# Altium schematic sheet HD3SS215_PINOUT.SchDoc
size C; SheetNumber: 11; SheetTotal: 14
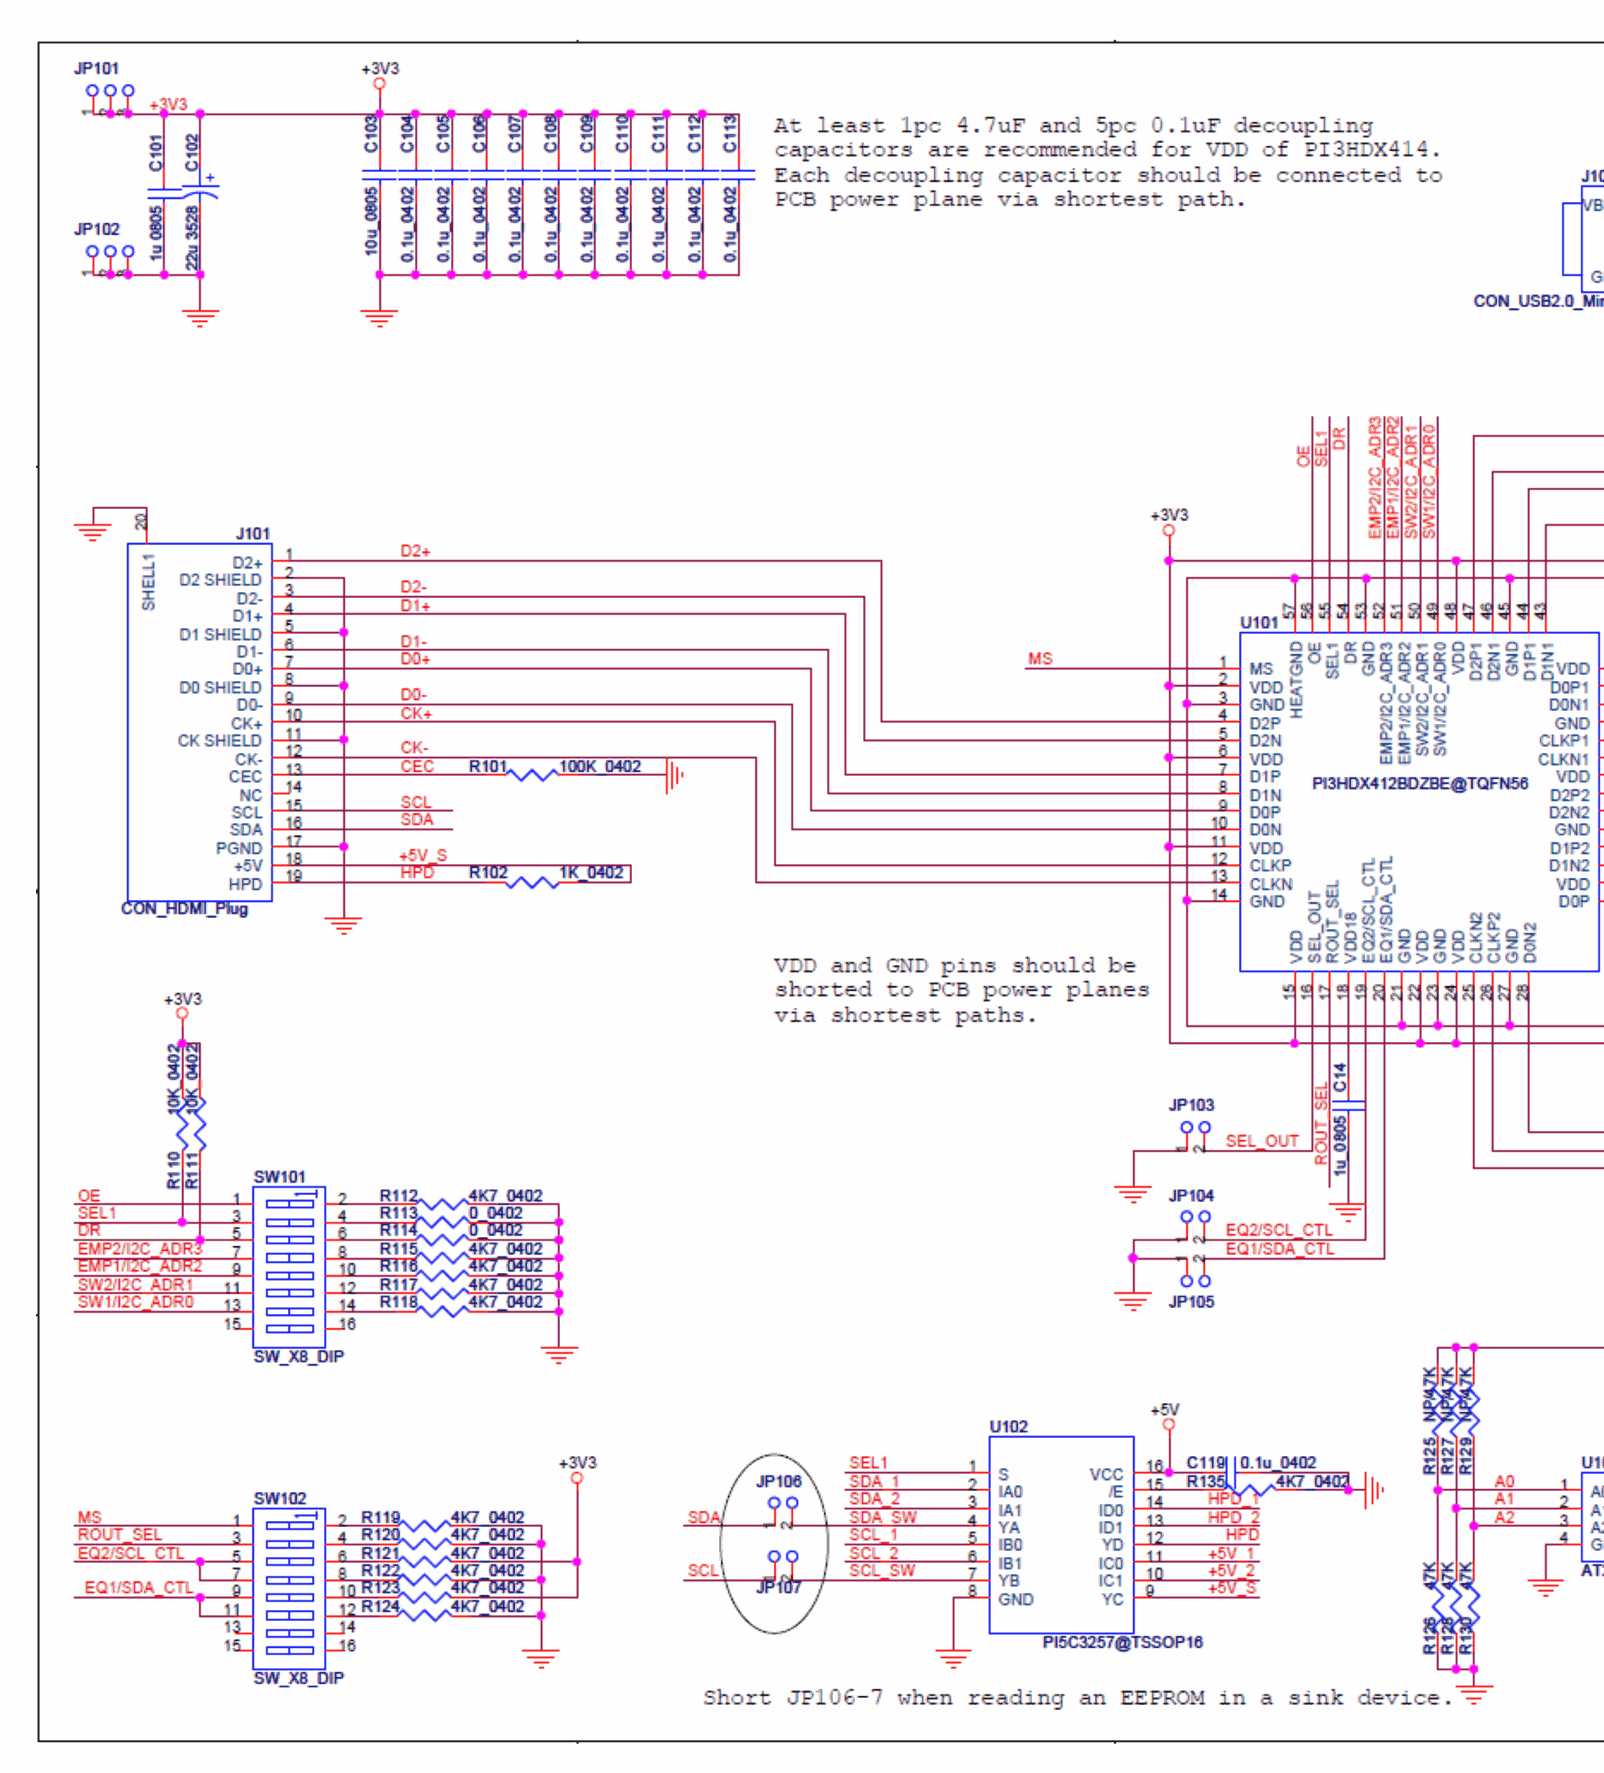
[diagram p0: HD3SS215_PINOUT.SchDoc, top left]
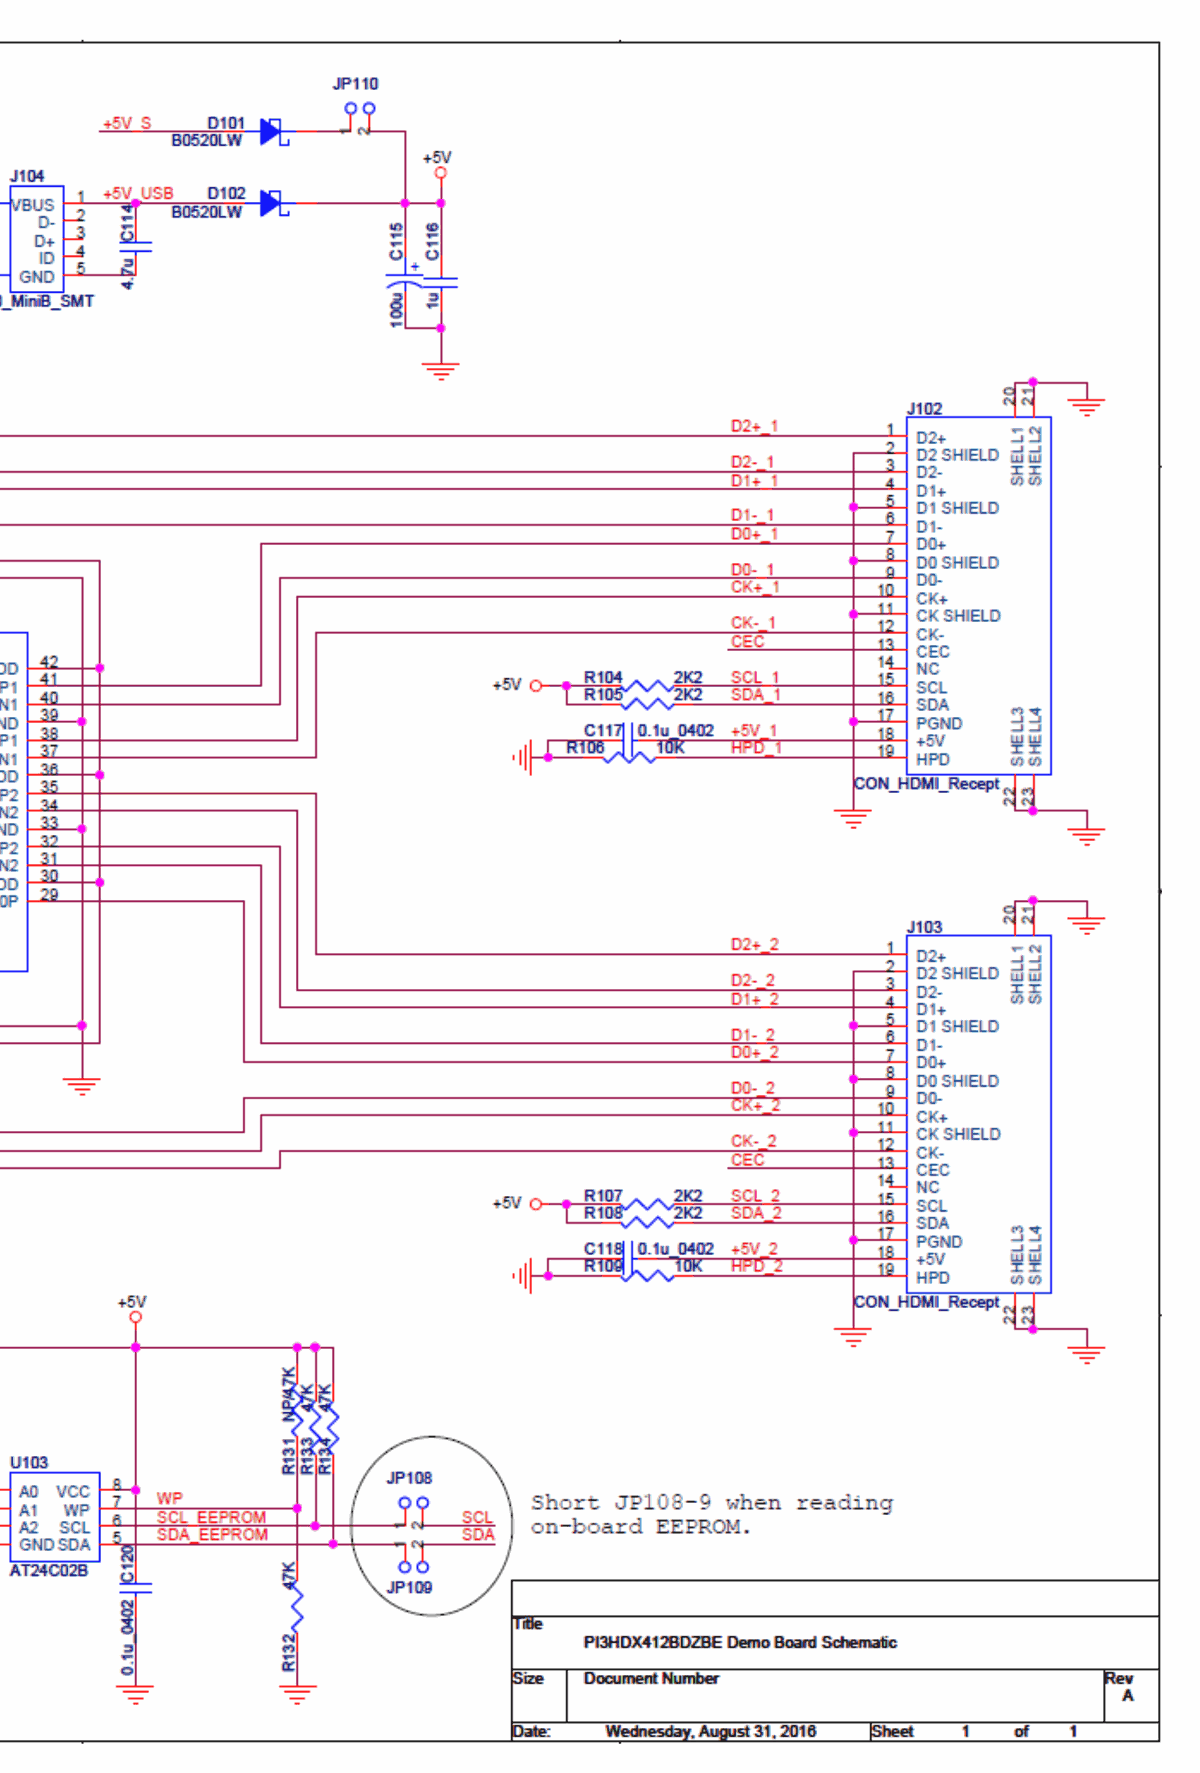
[diagram p1: HD3SS215_PINOUT.SchDoc, top right]
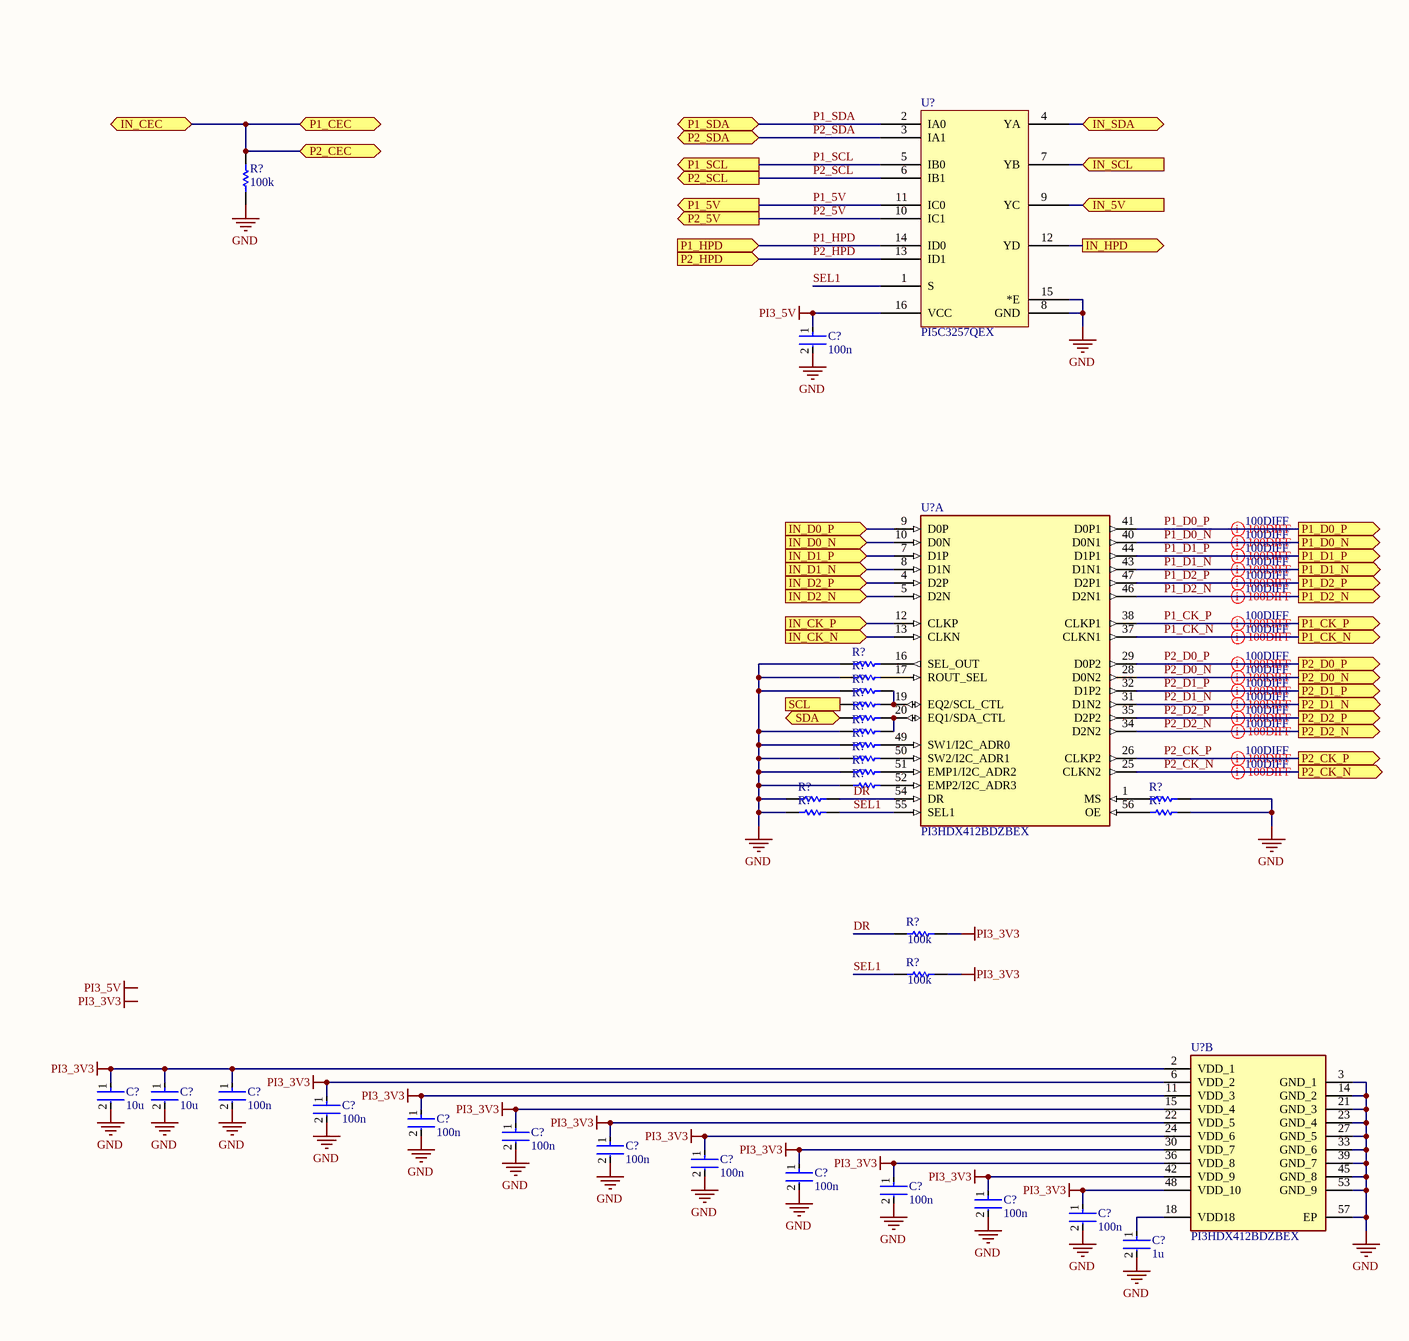
[diagram p2: HD3SS215_PINOUT.SchDoc, bottom left]
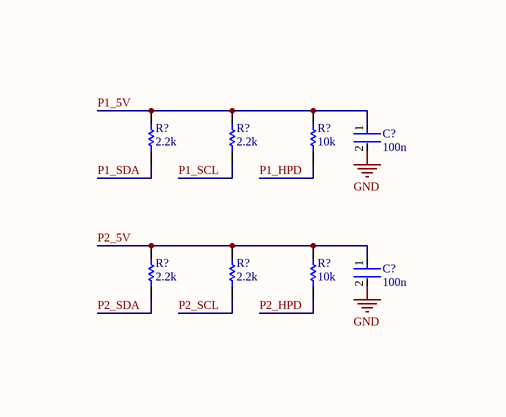
[diagram p3: HD3SS215_PINOUT.SchDoc, bottom right]

## Parts
(Parts that share a designator on the sheet are numbered #1, #2 ... from top to bottom, then left to right.)
C?#1  100n  [FP-0402-L_1_0_0_05-W_0_5-IPC_A]
C?#2  100n  [FP-0402-L_1_0_0_05-W_0_5-IPC_A]
C?#3  100n  [FP-0402-L_1_0_0_05-W_0_5-IPC_A]
C?#4  10u  [FP-0402-L_1_0_0_05-W_0_5-IPC_A]
C?#5  10u  [FP-0402-L_1_0_0_05-W_0_5-IPC_A]
C?#6  100n  [FP-0402-L_1_0_0_05-W_0_5-IPC_A]
C?#7  100n  [FP-0402-L_1_0_0_05-W_0_5-IPC_A]
C?#8  100n  [FP-0402-L_1_0_0_05-W_0_5-IPC_A]
C?#9  100n  [FP-0402-L_1_0_0_05-W_0_5-IPC_A]
C?#10  100n  [FP-0402-L_1_0_0_05-W_0_5-IPC_A]
C?#11  100n  [FP-0402-L_1_0_0_05-W_0_5-IPC_A]
C?#12  100n  [FP-0402-L_1_0_0_05-W_0_5-IPC_A]
C?#13  100n  [FP-0402-L_1_0_0_05-W_0_5-IPC_A]
C?#14  100n  [FP-0402-L_1_0_0_05-W_0_5-IPC_A]
C?#15  100n  [FP-0402-L_1_0_0_05-W_0_5-IPC_A]
C?#16  1u  [FP-0402-L_1_0_0_05-W_0_5-IPC_A]
R?#1  100k  [R0603B]
R?#2  2.2k  [R0603B]
R?#3  2.2k  [R0603B]
R?#4  10k  [R0603B]
R?#5  2.2k  [R0603B]
R?#6  2.2k  [R0603B]
R?#7  10k  [R0603B]
R?#8  0402 JUMPER  [RESC1005X40X25ML05T05]  (value not drawn)
R?#9  0402 JUMPER  [RESC1005X40X25ML05T05]  (value not drawn)
R?#10  0402 JUMPER  [RESC1005X40X25ML05T05]  (value not drawn)
R?#11  0402 JUMPER  [RESC1005X40X25ML05T05]  (value not drawn)
R?#12  0402 JUMPER  [RESC1005X40X25ML05T05]  (value not drawn)
R?#13  0402 JUMPER  [RESC1005X40X25ML05T05]  (value not drawn)
R?#14  0402 JUMPER  [RESC1005X40X25ML05T05]  (value not drawn)
R?#15  0402 JUMPER  [RESC1005X40X25ML05T05]  (value not drawn)
R?#16  0402 JUMPER  [RESC1005X40X25ML05T05]  (value not drawn)
R?#17  0402 JUMPER  [RESC1005X40X25ML05T05]  (value not drawn)
R?#18  0402 JUMPER  [RESC1005X40X25ML05T05]  (value not drawn)
R?#19  DNP  [RESC1005X40X25ML05T05]  (value not drawn)
R?#20  0402 JUMPER  [RESC1005X40X25ML05T05]  (value not drawn)
R?#21  DNP  [RESC1005X40X25ML05T05]  (value not drawn)
R?#22  100k  [R0603B]
R?#23  100k  [R0603B]
U?#1  PI5C3257QEX  [SOP64P600X175-16N]
U?#2  PI3HDX412BDZBEX  [QFN50P800X800X84_HS-57N]  (part A of 2)
U?#3  PI3HDX412BDZBEX  [QFN50P800X800X84_HS-57N]  (part B of 2)

## Ports
IN_5V (in), IN_CEC (bidir), IN_CK_N (in), IN_CK_P (in), IN_D0_N (in), IN_D0_P (in), IN_D1_N (in), IN_D1_P (in), IN_D2_N (in), IN_D2_P (in), IN_HPD (out), IN_SCL (in), IN_SDA (bidir), P1_5V (out), P1_CEC (bidir), P1_CK_N (out), P1_CK_P (out), P1_D0_N (out), P1_D0_P (out), P1_D1_N (out), P1_D1_P (out), P1_D2_N (out), P1_D2_P (out), P1_HPD (in), P1_SCL (out), P1_SDA (bidir), P2_5V (out), P2_CEC (bidir), P2_CK_N (out), P2_CK_P (out), P2_D0_N (out), P2_D0_P (out), P2_D1_N (out), P2_D1_P (out), P2_D2_N (out), P2_D2_P (out), P2_HPD (in), P2_SCL (out), P2_SDA (bidir), SCL (in), SDA (bidir)

## Nets
GND: C?#1.2 C?#2.2 C?#3.2 C?#4.2 C?#5.2 C?#6.2 C?#7.2 C?#8.2 C?#9.2 C?#10.2 C?#11.2 C?#12.2 C?#13.2 C?#14.2 C?#15.2 C?#16.2 R?#1.2 R?#8.1 R?#9.1 R?#10.1 R?#13.1 R?#14.1 R?#15.1 R?#16.1 R?#17.1 R?#18.1 R?#19.1 R?#20.1 R?#21.1 U?#1.8(GND) U?#1.15(*E) U?#3.3(GND_1) U?#3.14(GND_2) U?#3.21(GND_3) U?#3.23(GND_4) U?#3.27(GND_5) U?#3.33(GND_6) U?#3.39(GND_7) U?#3.45(GND_8) U?#3.53(GND_9) U?#3.57(EP)
PI3_3V3: C?#4.1 C?#5.1 C?#6.1 C?#7.1 C?#8.1 C?#9.1 C?#10.1 C?#11.1 C?#12.1 C?#13.1 C?#14.1 C?#15.1 R?#22.1 R?#23.1 U?#3.2(VDD_1) U?#3.6(VDD_2) U?#3.11(VDD_3) U?#3.15(VDD_4) U?#3.22(VDD_5) U?#3.24(VDD_6) U?#3.30(VDD_7) U?#3.36(VDD_8) U?#3.42(VDD_9) U?#3.48(VDD_10)
PI3_5V: C?#2.1 U?#1.16(VCC)
DR: R?#18.2 R?#22.2 U?#2.54(DR)
IN_5V: U?#1.9(YC) ; port IN_5V
IN_CEC: R?#1.1 ; port IN_CEC, port P1_CEC, port P2_CEC
IN_CK_N: U?#2.13(CLKN) ; port IN_CK_N
IN_CK_P: U?#2.12(CLKP) ; port IN_CK_P
IN_D0_N: U?#2.10(D0N) ; port IN_D0_N
IN_D0_P: U?#2.9(D0P) ; port IN_D0_P
IN_D1_N: U?#2.8(D1N) ; port IN_D1_N
IN_D1_P: U?#2.7(D1P) ; port IN_D1_P
IN_D2_N: U?#2.5(D2N) ; port IN_D2_N
IN_D2_P: U?#2.4(D2P) ; port IN_D2_P
IN_HPD: U?#1.12(YD) ; port IN_HPD
IN_SCL: U?#1.7(YB) ; port IN_SCL
IN_SDA: U?#1.4(YA) ; port IN_SDA
P1_5V: C?#1.1 R?#2.1 R?#3.1 R?#4.1 U?#1.11(IC0) ; port P1_5V
P1_CK_N: U?#2.37(CLKN1) ; port P1_CK_N
P1_CK_P: U?#2.38(CLKP1) ; port P1_CK_P
P1_D0_N: U?#2.40(D0N1) ; port P1_D0_N
P1_D0_P: U?#2.41(D0P1) ; port P1_D0_P
P1_D1_N: U?#2.43(D1N1) ; port P1_D1_N
P1_D1_P: U?#2.44(D1P1) ; port P1_D1_P
P1_D2_N: U?#2.46(D2N1) ; port P1_D2_N
P1_D2_P: U?#2.47(D2P1) ; port P1_D2_P
P1_HPD: R?#4.2 U?#1.14(ID0) ; port P1_HPD
P1_SCL: R?#3.2 U?#1.5(IB0) ; port P1_SCL
P1_SDA: R?#2.2 U?#1.2(IA0) ; port P1_SDA
P2_5V: C?#3.1 R?#5.1 R?#6.1 R?#7.1 U?#1.10(IC1) ; port P2_5V
P2_CK_N: U?#2.25(CLKN2) ; port P2_CK_N
P2_CK_P: U?#2.26(CLKP2) ; port P2_CK_P
P2_D0_N: U?#2.28(D0N2) ; port P2_D0_N
P2_D0_P: U?#2.29(D0P2) ; port P2_D0_P
P2_D1_N: U?#2.31(D1N2) ; port P2_D1_N
P2_D1_P: U?#2.32(D1P2) ; port P2_D1_P
P2_D2_N: U?#2.34(D2N2) ; port P2_D2_N
P2_D2_P: U?#2.35(D2P2) ; port P2_D2_P
P2_HPD: R?#7.2 U?#1.13(ID1) ; port P2_HPD
P2_SCL: R?#6.2 U?#1.6(IB1) ; port P2_SCL
P2_SDA: R?#5.2 U?#1.3(IA1) ; port P2_SDA
SCL: R?#11.1 ; port SCL
SDA: R?#12.1 ; port SDA
SEL1: R?#19.2 R?#23.2 U?#1.1(S) U?#2.55(SEL1)
NetC?#16_1: C?#16.1 U?#3.18(VDD18)
NetR?#8_2: R?#8.2 U?#2.16(SEL_OUT)
NetR?#9_2: R?#9.2 U?#2.17(ROUT_SEL)
NetR?#10_2: R?#10.2 R?#11.2 U?#2.19(EQ2/SCL_CTL)
NetR?#12_2: R?#12.2 R?#13.2 U?#2.20(EQ1/SDA_CTL)
NetR?#14_2: R?#14.2 U?#2.49(SW1/I2C_ADR0)
NetR?#15_2: R?#15.2 U?#2.50(SW2/I2C_ADR1)
NetR?#16_2: R?#16.2 U?#2.51(EMP1/I2C_ADR2)
NetR?#17_2: R?#17.2 U?#2.52(EMP2/I2C_ADR3)
NetR?#20_2: R?#20.2 U?#2.1(MS)
NetR?#21_2: R?#21.2 U?#2.56(OE)

## Layout directives
differential pair; differential pair class 100DIFF: P1_CK_N, P1_CK_P, P1_D0_N, P1_D0_P, P1_D1_N, P1_D1_P, P1_D2_N, P1_D2_P, P2_CK_N, P2_CK_P, P2_D0_N, P2_D0_P, P2_D1_N, P2_D1_P, P2_D2_N, P2_D2_P

## Notes on the sheet
- Labels drawn without touching a wire or pin: PI3_3V3, PI3_5V

## Library data of the parts
C?#1-C?#16 = CMP-001-00058-1: LARGE PADS, 0402 CAP, CHANGE COMMENT TO MATCH REAL P/N; Capacitor Type: Ceramic; Min Operating Temperature: -55°C; Mounting Technology: Surface Mount; Pins: 2; Case/Package: 0402; RoHS Compliant: Yes; Max Operating Temperature: 85°C
R?#1-R?#7 R?#22 R?#23 = CMP-009-00002-14: Resistor
R?#8-R?#21 = CMP-009-00118-2: READ THE NAME; Pins: 2; Component Type: Standard; Design Item ID: CMP-009-00206-2; Source: 0402jump.SchLib
U?#1 = CMP-015-00021-1: Quad 2: 1 Multiplexer / Demultiplexer 5 V Surface Mount Bus Switch - QSOP-16; Min Supply Voltage: 4.75V; Max Supply Voltage: 5.25V; Pins: 16; Case/Package: QSOP; Min Operating Temperature: -40°C; Max Operating Temperature: 85°C; Mounting Technology: Surface Mount
U?#2 U?#3 = CMP-015-00020-1: Analog Multiplexer Single 1: 2 56-Pin TQFN EP T/R / IC HDMI SW 1: 2 1.4B 56TQFN; Min Supply Voltage: 3V; Max Supply Voltage: 3.6V; Max Operating Temperature: 85°C; Mounting Technology: Surface Mount; Min Operating Temperature: -40°C; Pins: 56